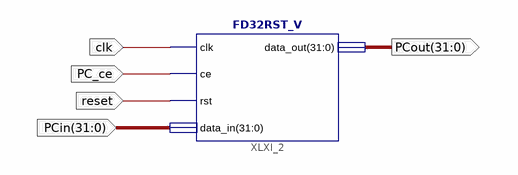
[diagram p0: schematic sheet 1]
// Xilinx ISE schematic PC_env.sch (spartan3) as structural Verilog: 1 symbols, 5 ports
module PC_env (
  input  clk,
  input  PC_ce,
  input  [31:0] PCin,
  input  reset,
  output [31:0] PCout
);

  FD32RST_V XLXI_2 (.clk(clk), .ce(PC_ce), .rst(reset), .data_in(PCin), .data_out(PCout));
endmodule
